# EAGLE design GasSensorCentral_v2.4 (EAGLE 7.4.0)
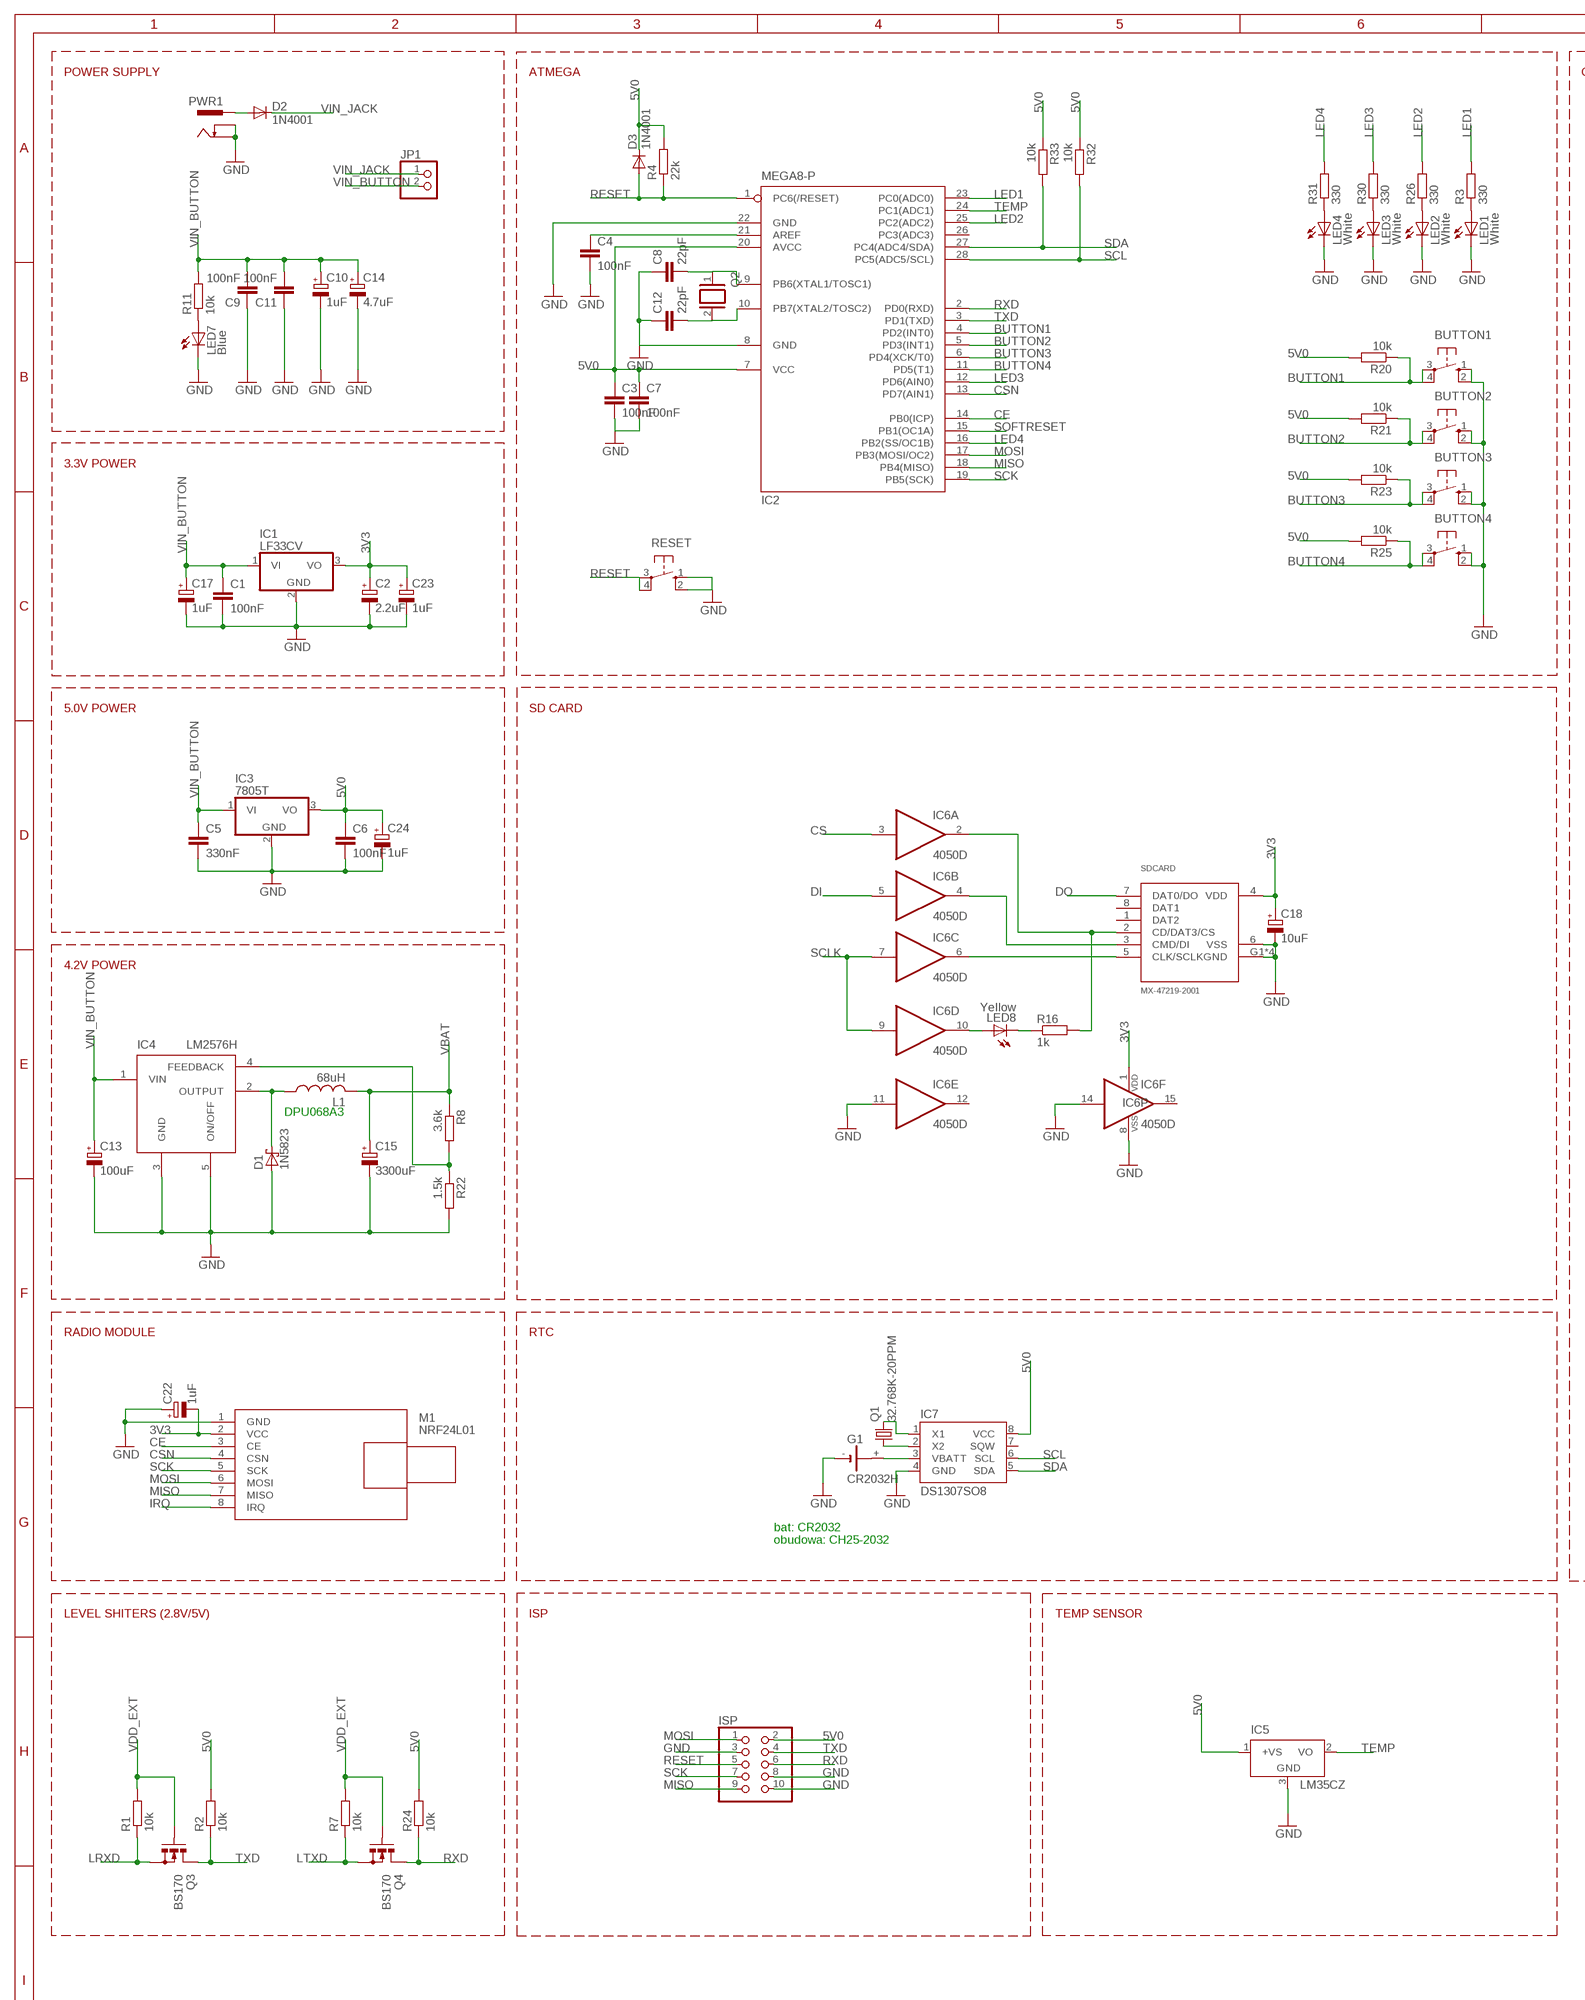
[diagram p0: schematic, sheet 1, part 1 of 2]
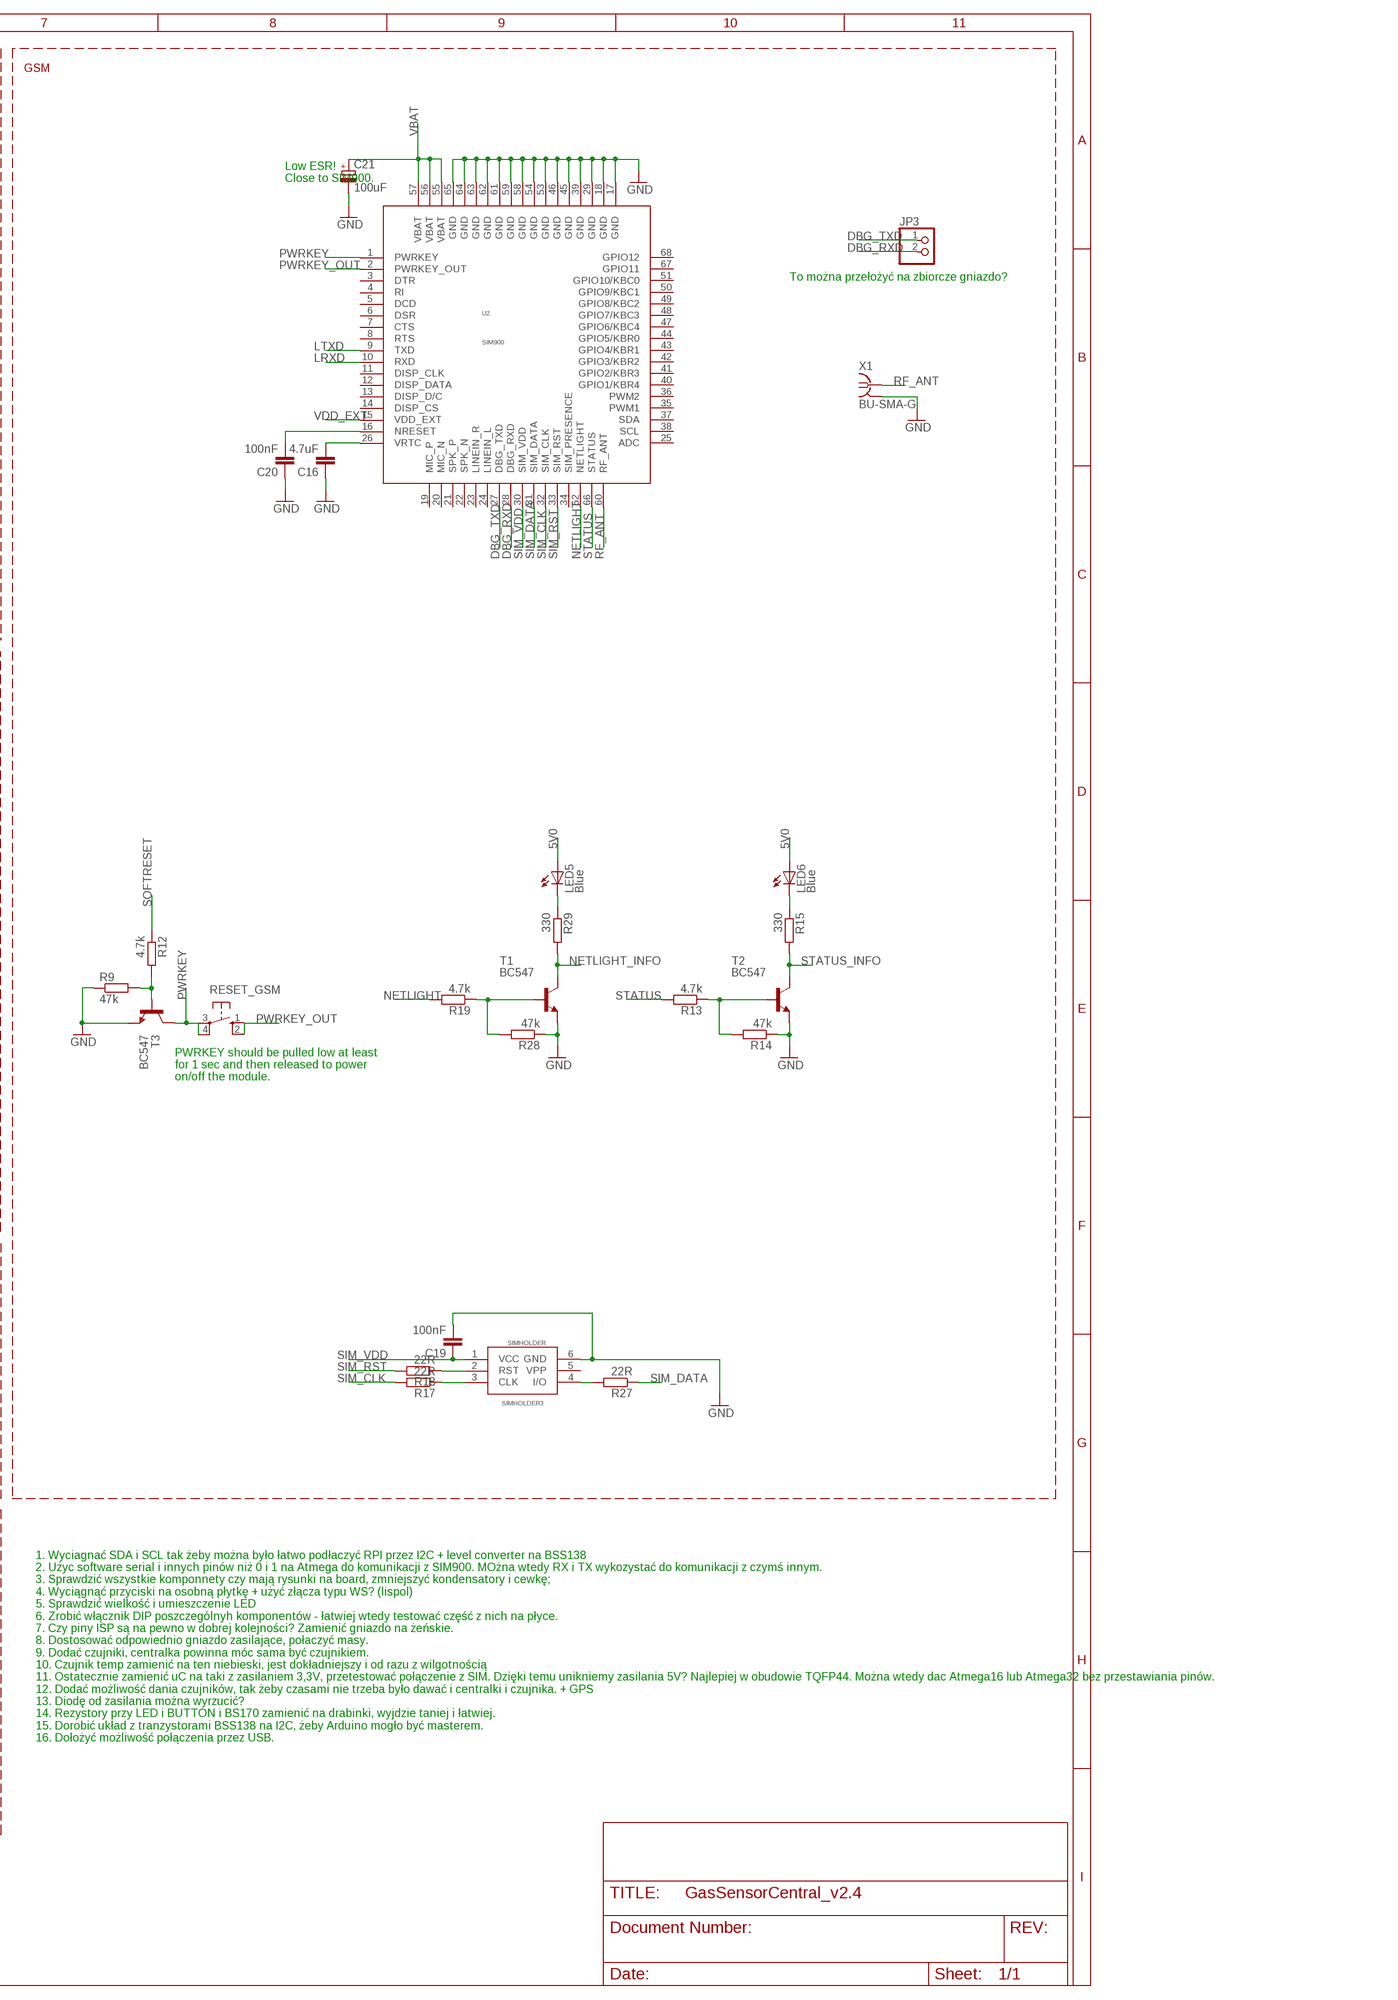
[diagram p1: schematic, sheet 1, part 2 of 2]

## Parts
BUTTON1  10-XX  [B3F-10XX]
BUTTON2  10-XX  [B3F-10XX]
BUTTON3  10-XX  [B3F-10XX]
BUTTON4  10-XX  [B3F-10XX]
C1  100nF  C-EU025-025X050  [C025-025X050]
C2  2.2uF  CPOL-EUE2.5-5  [E2,5-5]
C3  100nF  C-EU025-025X050  [C025-025X050]
C4  100nF  C-EU025-025X050  [C025-025X050]
C5  330nF  C-EU025-025X050  [C025-025X050]
C6  100nF  C-EU025-025X050  [C025-025X050]
C7  100nF  C-EU025-025X050  [C025-025X050]
C8  22pF  C-EU025-025X050  [C025-025X050]
C9  100nF  C-EU025-025X050  [C025-025X050]
C10  1uF  CPOL-EUE2.5-5  [E2,5-5]
C11  100nF  C-EU025-025X050  [C025-025X050]
C12  22pF  C-EU025-025X050  [C025-025X050]
C13  100uF  CPOL-EUE2.5-5  [E2,5-5]
C14  4.7uF  CPOL-EUE2.5-5  [E2,5-5]
C15  3300uF  CPOL-EUE5-13  [E5-13]
C16  4.7uF  C-EU025-025X050  [C025-025X050]
C17  1uF  CPOL-EUE2.5-5  [E2,5-5]
C18  10uF  CPOL-EUE2.5-5  [E2,5-5]
C19  100nF  C-EU025-025X050  [C025-025X050]
C20  100nF  C-EU025-025X050  [C025-025X050]
C21  100uF  CPOL-EUE2.5-5  [E2,5-5]
C22  1uF  CPOL-EUE2.5-5  [E2,5-5]
C23  1uF  CPOL-EUE2.5-5  [E2,5-5]
C24  1uF  CPOL-EUE2.5-5  [E2,5-5]
D1  1N5823  1N5817-B  [DO41-7.6]
D2  1N4001  1N4004  [DO41-10]
D3  1N4001  1N4004  [DO41-10]
G1  CR2032H  [CR2032H]
IC1  LF33CV  7805T  [TO220H]
IC2  MEGA8-P  [DIL28-3]
IC3  7805T  [TO220H]
IC4  LM2576H  [TO220-52]
IC5  LM35CZ  [TO92]
IC6  4050D  [SO16]
IC7  DS1307SO8  [SO08]
ISP  PINHD-2X5  [2X05]
JP1  PINHD-1X2  [1X02]
JP3  PINHD-1X2  [1X02]
L1  68uH  L-USTJ4-U1  [TJ4-U1]
LED1  White  LED3MM  [LED3MM]
LED2  White  LED3MM  [LED3MM]
LED3  White  LED3MM  [LED3MM]
LED4  White  LED3MM  [LED3MM]
LED5  Blue  LED3MM  [LED3MM]
LED6  Blue  LED3MM  [LED3MM]
LED7  Blue  LED3MM  [LED3MM]
LED8  Yellow  LED3MM  [LED3MM]
M1  NRF24L01  WIRELESS-NRF24L01-PA-EXT  [WIRELESS-NRD24L01-PA-EXT]
PWR1  PWR-JAKPWR_JACK_UNI_MILLING  [PWR_JACK_UNI_MILLING]
Q1  32.768K-20PPM  CRYSTALTC26V  [TC26V]
Q2  XTAL/S  [QS]
Q3  BS170  [SOT54E]
Q4  BS170  [SOT54E]
R1  10k  R-EU_0207/10  [0207/10]
R2  10k  R-EU_0207/10  [0207/10]
R3  330  R-EU_0207/10  [0207/10]
R4  22k  R-EU_0207/10  [0207/10]
R7  10k  R-EU_0207/10  [0207/10]
R8  3.6k  R-EU_0207/10  [0207/10]
R9  47k  R-EU_0207/10  [0207/10]
R11  10k  R-EU_0207/10  [0207/10]
R12  4.7k  R-EU_0207/10  [0207/10]
R13  4.7k  R-EU_0207/10  [0207/10]
R14  47k  R-EU_0207/10  [0207/10]
R15  330  R-EU_0207/10  [0207/10]
R16  1k  R-EU_0207/10  [0207/10]
R17  22R  R-EU_0207/10  [0207/10]
R18  22R  R-EU_0207/10  [0207/10]
R19  4.7k  R-EU_0207/10  [0207/10]
R20  10k  R-EU_0207/10  [0207/10]
R21  10k  R-EU_0207/10  [0207/10]
R22  1.5k  R-EU_0207/10  [0207/10]
R23  10k  R-EU_0207/10  [0207/10]
R24  10k  R-EU_0207/10  [0207/10]
R25  10k  R-EU_0207/10  [0207/10]
R26  330  R-EU_0207/10  [0207/10]
R27  22R  R-EU_0207/10  [0207/10]
R28  47k  R-EU_0207/10  [0207/10]
R29  330  R-EU_0207/10  [0207/10]
R30  330  R-EU_0207/10  [0207/10]
R31  330  R-EU_0207/10  [0207/10]
R32  10k  R-EU_0207/10  [0207/10]
R33  10k  R-EU_0207/10  [0207/10]
RESET  10-XX  [B3F-10XX]
RESET_GSM  10-XX  [B3F-10XX]
SDCARD  MX-47219-2001  [MX-47219-2001]
SIMHOLDER  SIMHOLDER3  [SIMHOLDER3]
T1  BC547  [TO92]
T2  BC547  [TO92]
T3  BC547  [TO92]
U2  SIM900  [SIM900]
X1  BU-SMA-G  [BU-SMA-G]

## Nets
3V3: C2.+ C18.+ C22.- C23.+ IC1.3(VO) IC6.1(P:VDD) M1.2(VCC) SDCARD.4(VDD)
5V0: C3.1 C6.1 C7.1 C24.+ D3.C IC2.7(VCC) IC2.20(AVCC) IC3.3(VO) IC5.1(+VS) IC7.8(VCC) ISP.2 LED5.A LED6.A R2.2 R4.2 R20.2 R21.2 R23.2 R24.2 R25.2 R32.1 R33.1
BUTTON1: BUTTON1.3(P) BUTTON1.4(P1) IC2.4(PD2(INT0)) R20.1
BUTTON2: BUTTON2.3(P) BUTTON2.4(P1) IC2.5(PD3(INT1)) R21.1
BUTTON3: BUTTON3.3(P) BUTTON3.4(P1) IC2.6(PD4(XCK/T0)) R23.1
BUTTON4: BUTTON4.3(P) BUTTON4.4(P1) IC2.11(PD5(T1)) R25.1
CE: IC2.14(PB0(ICP)) M1.3(CE)
CS: IC6.3(A:I)
CSN: IC2.13(PD7(AIN1)) M1.4(CSN)
DBG_RXD: JP3.2 U2.28(DBG_RXD)
DBG_TXD: JP3.1 U2.27(DBG_TXD)
DI: IC6.5(B:I)
DO: SDCARD.7(DAT0/DO)
GND: BUTTON1.1(S) BUTTON1.2(S1) BUTTON2.1(S) BUTTON2.2(S1) BUTTON3.1(S) BUTTON3.2(S1) BUTTON4.1(S) BUTTON4.2(S1) C1.2 C2.- C3.2 C4.2 C5.2 C6.2 C7.2 C8.1 C9.1 C10.- C11.1 C12.1 C13.- C14.- C15.- C16.1 C17.- C18.- C19.2 C20.1 C21.- C22.+ C23.- C24.- D1.A G1.- IC1.2(GND) IC2.8(GND) IC2.22(GND) IC3.2(GND) IC4.3(GND) IC4.5(ON/OFF) IC5.3(GND) IC6.8(P:VSS) IC6.11(E:I) IC6.14(F:I) IC7.4(GND) ISP.3 ISP.8 ISP.10 LED1.K(C) LED2.K(C) LED3.K(C) LED4.K(C) LED7.K(C) M1.1(GND) PWR1.- PWR1.-- R9.1 R14.1 R22.2 R28.1 RESET.1(S) RESET.2(S1) SDCARD.6(VSS) SDCARD.G1(GND) SDCARD.G2(GND) SDCARD.G3(GND) SDCARD.G4(GND) SIMHOLDER.6(GND) T1.1(E) T2.1(E) T3.1(E) U2.17(GND) U2.18(GND) U2.29(GND) U2.39(GND) U2.45(GND) U2.46(GND) U2.53(GND) U2.54(GND) U2.58(GND) U2.59(GND) U2.61(GND) U2.62(GND) U2.63(GND) U2.64(GND) U2.65(GND) X1.2 X1.3 X1.4 X1.5
IRQ: M1.8(IRQ)
LED1: IC2.23(PC0(ADC0)) R3.2
LED2: IC2.25(PC2(ADC2)) R26.2
LED3: IC2.12(PD6(AIN0)) R30.2
LED4: IC2.16(PB2(SS/OC1B)) R31.2
LRXD: Q3.S R1.1 U2.10(RXD)
LTXD: Q4.S R7.1 U2.9(TXD)
MISO: IC2.18(PB4(MISO)) ISP.9 M1.7(MISO)
MOSI: IC2.17(PB3(MOSI/OC2)) ISP.1 M1.6(MOSI)
N$1: C4.1 IC2.21(AREF)
N$2: IC7.2(X2) Q1.1
N$3: IC4.4(FEEDBACK) R8.2 R22.1
N$4: D2.A PWR1.+
N$5: LED1.A R3.1
N$6: R27.2 SIMHOLDER.4(I/O)
N$7: LED5.K(C) R29.1
N$8: IC7.1(X1) Q1.2
N$9: R13.1 R14.2 T2.2(B)
N$10: LED7.A R11.1
N$11: LED6.K(C) R15.1
N$12: D1.C IC4.2(OUTPUT) L1.1
N$13: C20.2 U2.16(NRESET)
N$14: R9.2 R12.2 T3.2(B)
N$15: R19.1 R28.2 T1.2(B)
N$16: G1.+ IC7.3(VBATT)
N$17: C16.2 U2.26(VRTC)
N$18: LED2.A R26.1
N$19: LED3.A R30.1
N$20: LED4.A R31.1
N$24: R18.1 SIMHOLDER.2(RST)
N$25: R17.1 SIMHOLDER.3(CLK)
N$26: IC6.2(A:O) R16.2 SDCARD.2(CD/DAT3/CS)
N$27: IC6.4(B:O) SDCARD.3(CMD/DI)
N$29: C8.2 IC2.9(PB6(XTAL1/TOSC1)) Q2.1
N$30: IC6.6(C:O) SDCARD.5(CLK/SCLK)
N$31: IC6.10(D:O) LED8.A
N$32: LED8.K(C) R16.1
N$35: C12.2 IC2.10(PB7(XTAL2/TOSC2)) Q2.2
NETLIGHT: R19.2 U2.52(NETLIGHT)
NETLIGHT_INFO: R29.2 T1.3(C)
PWRKEY: RESET_GSM.3(P) RESET_GSM.4(P1) T3.3(C) U2.1(PWRKEY)
PWRKEY_OUT: RESET_GSM.1(S) RESET_GSM.2(S1) U2.2(PWRKEY_OUT)
RESET: D3.A IC2.1(PC6(/RESET)) ISP.5 R4.1 RESET.3(P) RESET.4(P1)
RF_ANT: U2.60(RF_ANT) X1.1
RXD: IC2.2(PD0(RXD)) ISP.6 Q4.D R24.1
SCK: IC2.19(PB5(SCK)) ISP.7 M1.5(SCK)
SCL: IC2.28(PC5(ADC5/SCL)) IC7.6(SCL) R32.2
SCLK: IC6.7(C:I) IC6.9(D:I)
SDA: IC2.27(PC4(ADC4/SDA)) IC7.5(SDA) R33.2
SIM_CLK: R17.2 U2.32(SIM_CLK)
SIM_DATA: R27.1 U2.31(SIM_DATA)
SIM_RST: R18.2 U2.33(SIM_RST)
SIM_VDD: C19.1 SIMHOLDER.1(VCC) U2.30(SIM_VDD)
SOFTRESET: IC2.15(PB1(OC1A)) R12.1
STATUS: R13.2 U2.66(STATUS)
STATUS_INFO: R15.2 T2.3(C)
TEMP: IC2.24(PC1(ADC1)) IC5.2(VO)
TXD: IC2.3(PD1(TXD)) ISP.4 Q3.D R2.1
VBAT: C15.+ C21.+ L1.2 R8.1 U2.55(VBAT) U2.56(VBAT) U2.57(VBAT)
VDD_EXT: Q3.G Q4.G R1.2 R7.2 U2.15(VDD_EXT)
VIN_BUTTON: C1.1 C5.1 C9.2 C10.+ C11.2 C13.+ C14.+ C17.+ IC1.1(VI) IC3.1(VI) IC4.1(VIN) JP1.2 R11.2
VIN_JACK: D2.C JP1.1
Unconnected: IC2.26(PC3(ADC3)) IC6.12(E:O) IC6.15(F:O) IC7.7(SQW) SDCARD.1(DAT2) SDCARD.8(DAT1) SIMHOLDER.5(VPP) U2.3(DTR) U2.4(RI) U2.5(DCD) U2.6(DSR) U2.7(CTS) U2.8(RTS) U2.11(DISP_CLK) U2.12(DISP_DATA) U2.13(DISP_D/C) U2.14(DISP_CS) U2.19(MIC_P) U2.20(MIC_N) U2.21(SPK_P) U2.22(SPK_N) U2.23(LINEIN_R) U2.24(LINEIN_L) U2.25(ADC) U2.34(SIM_PRESENCE) U2.35(PWM1) U2.36(PWM2) U2.37(SDA) U2.38(SCL) U2.40(GPIO1/KBR4) U2.41(GPIO2/KBR3) U2.42(GPIO3/KBR2) U2.43(GPIO4/KBR1) U2.44(GPIO5/KBR0) U2.47(GPIO6/KBC4) U2.48(GPIO7/KBC3) U2.49(GPIO8/KBC2) U2.50(GPIO9/KBC1) U2.51(GPIO10/KBC0) U2.67(GPIO11) U2.68(GPIO12)

## Notes on the sheet
- POWER SUPPLY | ATMEGA | GSM
- Low ESR!
  Close to SIM900.
- To można przełożyć na zbiorcze gniazdo?
- 3.3V POWER
- 5.0V POWER | SD CARD
- 4.2V POWER
- DPU068A3
- PWRKEY should be pulled low at least 
  for 1 sec and then released to power 
  on/off the module.
- RADIO MODULE | RTC
- bat: CR2032
  obudowa: CH25-2032
- LEVEL SHITERS (2.8V/5V) | ISP | TEMP SENSOR
- 1. Wyciagnać SDA i SCL tak żeby można było łatwo podłaczyć RPI przez I2C + level converter na BSS138
  2. Użyc software serial i innych pinów niż 0 i 1 na Atmega do komunikacji z SIM900. MOżna wtedy RX i TX wykozystać do komunikacji z czymś innym.
  3. Sprawdzić wszystkie komponnety czy mają rysunki na board, zmniejszyć kondensatory i cewkę;
  4. Wyciągnąć przyciski na osobną płytkę + użyć złącza typu WS? (lispol)
  5. Sprawdzić wielkość i umieszczenie LED
  6. Zrobić włącznik DIP poszczególnyh komponentów - łatwiej wtedy testować część z nich na płyce.
  7. Czy piny ISP są na pewno w dobrej kolejności? Zamienić gniazdo na żeńskie.
  8. Dostosować odpowiednio gniazdo zasilające, połaczyć masy.
  9. Dodać czujniki, centralka powinna móc sama być czujnikiem.
  10. Czujnik temp zamienić na ten niebieski, jest dokładniejszy i od razu z wilgotnością
  11. Ostatecznie zamienić uC na taki z zasilaniem 3,3V, przetestować połączenie z SIM. Dzięki temu unikniemy zasilania 5V? Najlepiej w obudowie TQFP44. Można wtedy dac Atmega16 lub Atmega32 bez przestawiania pinów.
  12. Dodać możliwość dania czujników, tak żeby czasami nie trzeba było dawać i centralki i czujnika. + GPS
  13. Diodę od zasilania można wyrzucić?
  14. Rezystory przy LED i BUTTON i BS170 zamienić na drabinki, wyjdzie taniej i łatwiej.
  15. Dorobić układ z tranzystorami BSS138 na I2C, żeby Arduino mogło być masterem.
  16. Dołożyć możliwość połączenia przez USB.

## Library data of the parts
BUTTON1-BUTTON4 RESET RESET_GSM = switch-omron:10-XX: OMRON SWITCH; MPN: B3F-1000; OC_FARNELL: 176432; OC_NEWARK: 36M3542
C1 C3-C9 C11 C12 C16 C19 C20 = rcl:C-EU: CAPACITOR, European symbol
C2 C10 C13-C15 C17 C18 C21-C24 = rcl:CPOL-EU: POLARIZED CAPACITOR, European symbol
D1 = diode:1N581*: 1.0A SCHOTTKY BARRIER RECTIFIER Source: http://www.diodes.com/datasheets/ds23001.pdf
D2 D3 = diode:1N4004: DIODE general purpose rectifier, 1 A
G1 = hosho:CR2032H: LI BATTERY Varta
IC1 IC3 = linear:78*: Positive VOLTAGE REGULATOR Source: http://cache.national.com/ds/LM/LM78L05.pdf http://www.fairchildsemi.com/ds/LM/LM7805.pdf
IC2 = atmel:MEGA8-P: MICROCONTROLLER 8 Kbytes FLASH, 1 kbytes SRAM, 512 bytes EEPROM, USART, 4-channel 10 bit ADC, 2-channel 8 bit ADC Pin compatible with Atmega48, ATMega88, ATMega168 Source: avr.lbr; OC_FARNELL: unknown; OC_NEWARK: unknown
IC4 = hosho:LM2576H
IC5 = lm35:LM35: Single-Supply Centigrade Temperature Sensor Vout = (10mV/°C x Temp °C) +5mmmV Source: http://www.national.com/ds/LM/LM35.pdf
IC6 = 40xx:4050: Hex non-inverting BUFFER
IC7 = SparkFun-FreqCtrl:DS1307: I2C real-time clock with battery backup.
ISP = pinhead:PINHD-2X5: PIN HEADER
JP1 JP3 = pinhead:PINHD-1X2: PIN HEADER
L1 = rcl:L-US: INDUCTOR, American symbol
LED1-LED8 = led:LED: LED OSRAM: - CHIPLED LG R971, LG N971, LY N971, LG Q971, LY Q971, LO R971, LY R971 LH N974, LH R974 LS Q976, LO Q976, LY Q976 LO Q996 - Hyper CHIPLED LW Q18S LB Q993, LB Q99A, LB R99A - SideLED LS A670, LO A670, LY A670, LG A670, LP A670 LB A673, LV A673, LT A673, LW A673 LH A674 LY A675 LS A676, LA A676, LO A676, LY A676, LW A676 LS A679, LY A679, LG A679 - Hyper Micro SIDELED® LS Y876, LA Y876, LO Y876, LY Y876 LT Y87S - SmartLED LW L88C, LW L88S LB L89C, LB L89S, LG L890 LS L89K, LO L89K, LY L89K LS L896, LA L896, LO L896, LY L896 - TOPLED LS T670, LO T670, LY T670, LG T670, LP T670 LSG T670, LSP T670, LSY T670, LOP T670, LYG T670 LG T671, LOG T671, LSG T671 LB T673, LV T673, LT T673, LW T673 LH T674 LS T676, LA T676, LO T676, LY T676, LB T676, LH T676, LSB T676, LW T676 LB T67C, LV T67C, LT T67C, LS T67K, LO T67K, LY T67K, LW E67C LS E67B, LA E67B, LO E67B, LY E67B, LB E67C, LV E67C, LT E67C LW T67C LS T679, LY T679, LG T679 LS T770, LO T770, LY T770, LG T770, LP T770 LB T773, LV T773, LT T773, LW T773 LH T774 LS E675, LA E675, LY E675, LS T675 LS T776, LA T776, LO T776, LY T776, LB T776 LHGB T686 LT T68C, LB T68C - Hyper Mini TOPLED® LB M676 - Mini TOPLED Santana® LG M470 LS M47K, LO M47K, LY M47K Source: http://www.osram.convergy.de LUXEON: - LUMILED® LXK2-PW12-R00, LXK2-PW12-S00, LXK2-PW14-U00, LXK2-PW14-V00 LXK2-PM12-R00, LXK2-PM12-S00, LXK2-PM14-U00 LXK2-PE12-Q00, LXK2-PE12-R00, LXK2-PE12-S00, LXK2-PE14-T00, LXK2-PE14-U00 LXK2-PB12-K00, LXK2-PB12-L00, LXK2-PB12-M00, LXK2-PB14-N00, LXK2-PB14-P00, LXK2-PB14-Q00 LXK2-PR12-L00, LXK2-PR12-M00, LXK2-PR14-Q00, LXK2-PR14-R00 LXK2-PD12-Q00, LXK2-PD12-R00, LXK2-PD12-S00 LXK2-PH12-R00, LXK2-PH12-S00 LXK2-PL12-P00, LXK2-PL12-Q00, LXK2-PL12-R00 Source: www.luxeon.com KINGBRIGHT: KA-3528ASYC Source: www.kingbright.com
M1 = diy-modules:WIRELESS-NRF24L01-PA-EXT: 2.4 GHz Wireless Module based on NRF24L01 chip with preamplifier and external antenna
PWR1 = iMX233-OLINUXINO-MAXI_Rev_D:PWR-JAK
Q1 = crystal:CRYSTAL: CRYSTAL; OC_FARNELL: unknown; OC_NEWARK: unknown
Q2 = special:XTAL/S: CRYSTAL
Q3 Q4 = transistor-small-signal:BS170: N-CHANNEL MOS FET
R1-R4 R7-R9 R11-R33 = rcl:R-EU_: RESISTOR, European symbol
SDCARD = hosho:MX-47219-2001
SIMHOLDER = SparkFun2:SIMHOLDER3
T1-T3 = transistor:BC547: NPN TRANSISTOR
U2 = ICs_v54:SIM900
X1 = hosho:BU-SMA-G: FEMALE SMA CONNECTOR Radiall distributor RS 193-9117; OC_FARNELL: unknown; OC_NEWARK: unknown

## Board
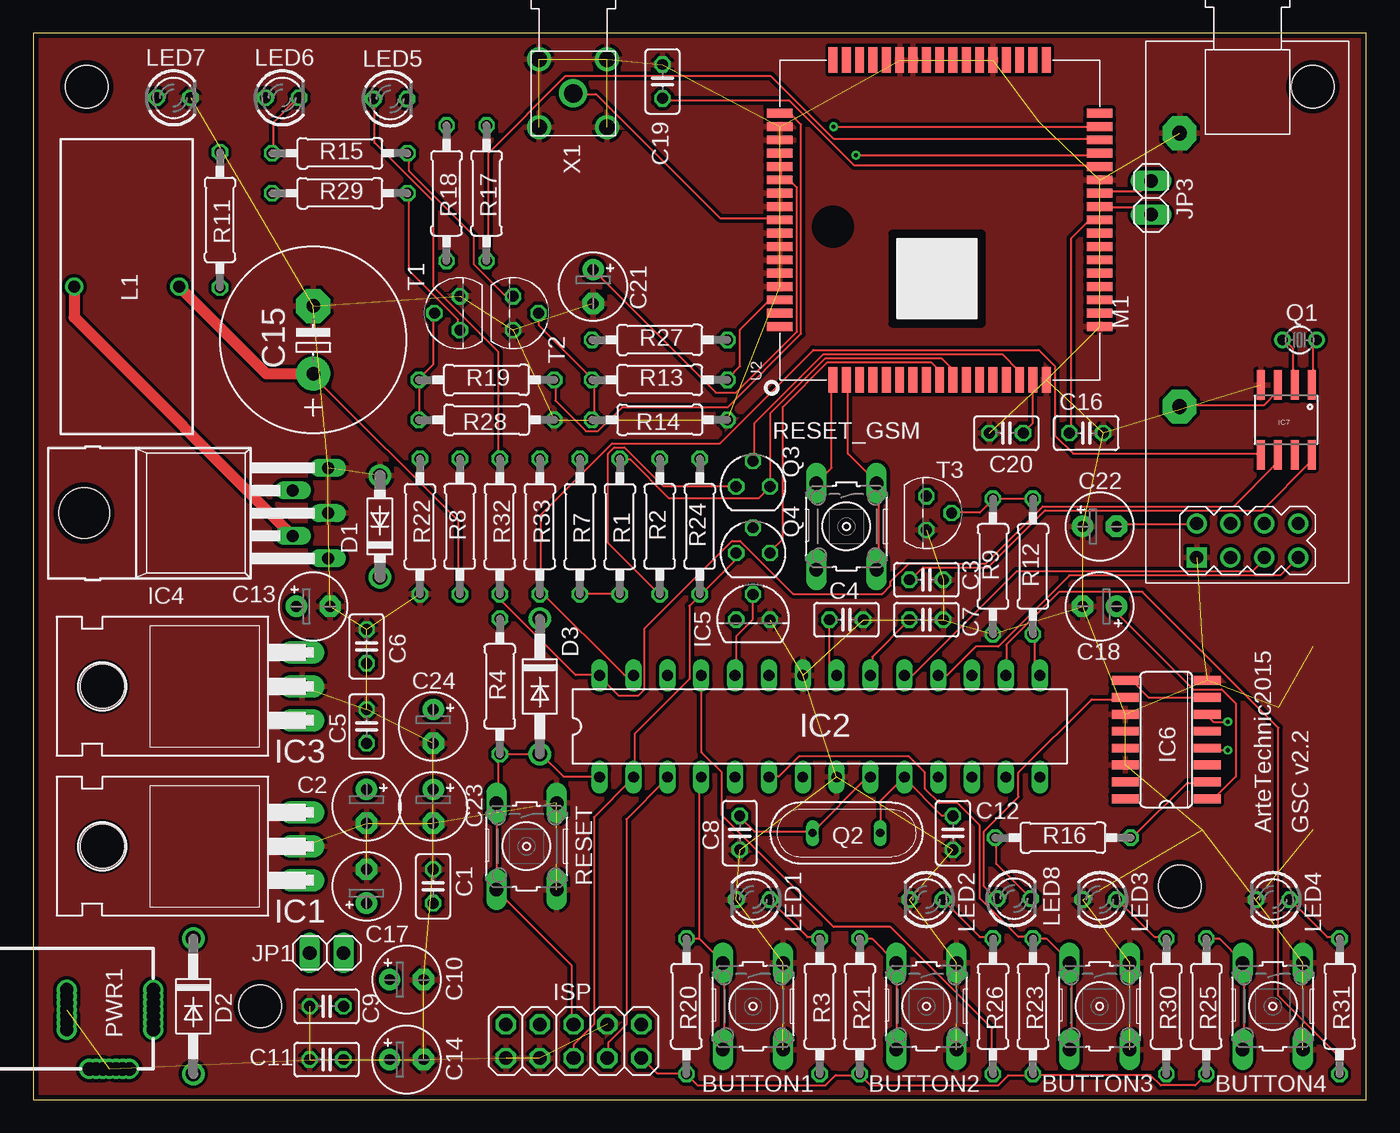
[diagram p2: board, top side]
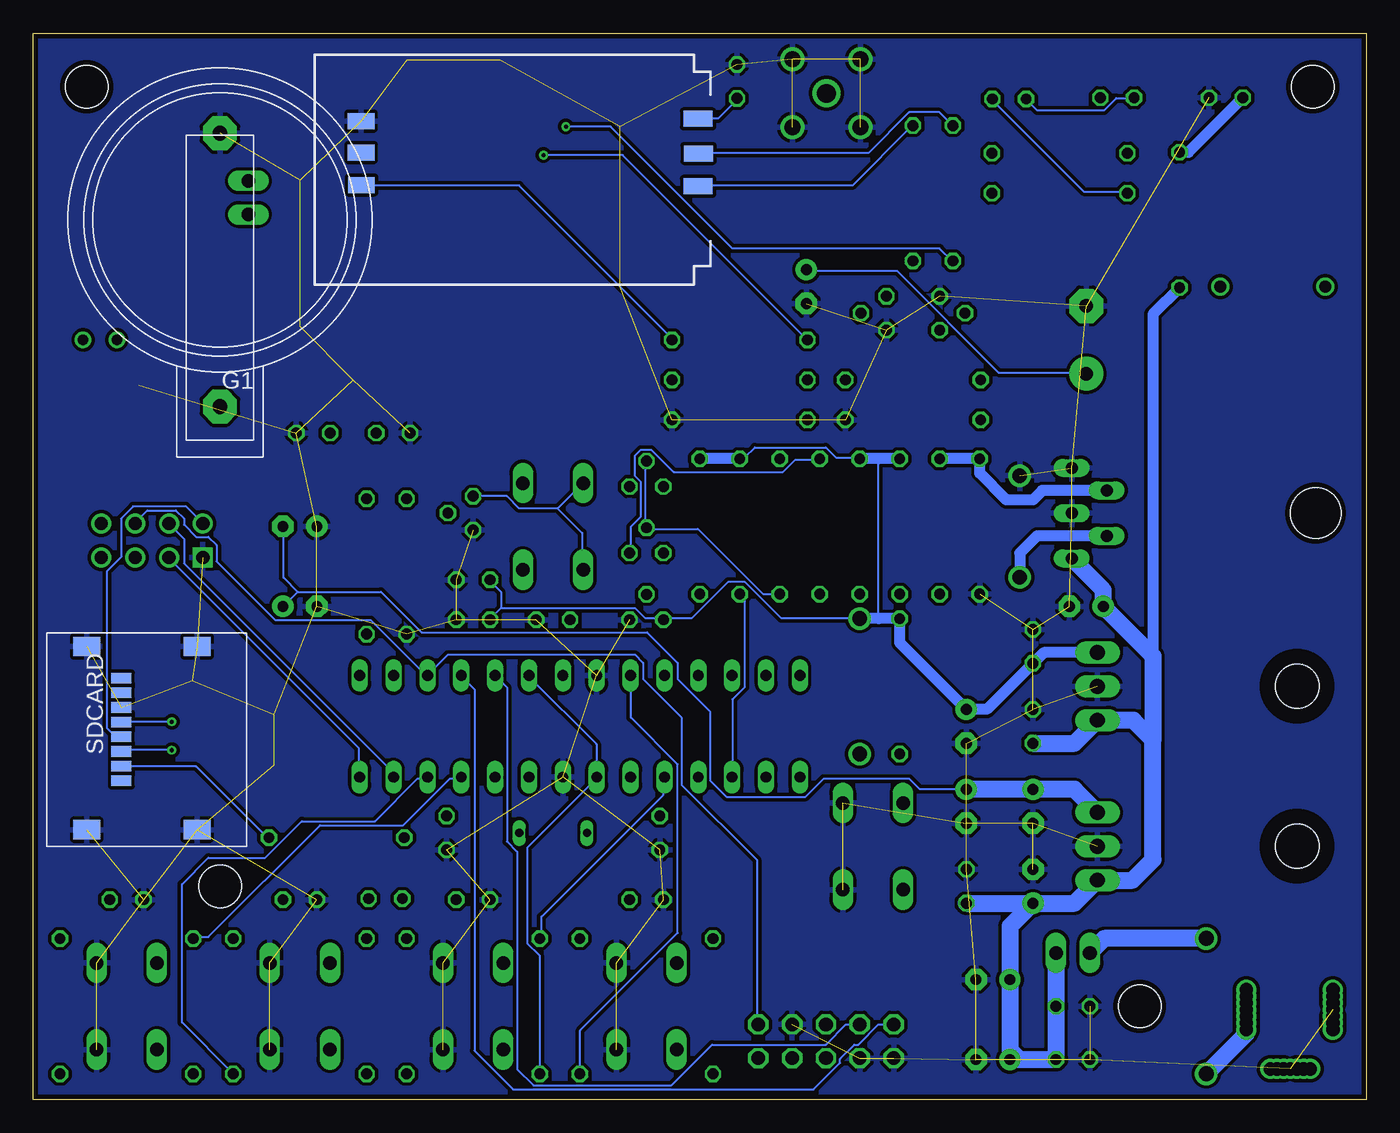
[diagram p3: board, bottom side, seen from below]

Size 100 x 80 mm. Coordinates in mm from the lower left corner, seen from the top.
Outline: 0,0 100,0 100,80 0,80 0,0
Copper layers (1*16): Top 0.0356mm / dielectric 1.5011mm / Bottom 0.0356mm
Design rules "oshpark-2layer *": minimum track width 6mil, minimum drill 13mil, track to track 6mil, track to pad 6mil, pad to pad 6mil, via to via 6mil, smd to smd 6mil, copper to edge 15mil, drill to drill 6mil, minimum pad ring 7mil, minimum via ring 7mil, stop-mask expansion 4mil, vias tented up to drill 12mil, thermal gap 10mil
Holes 3.2 mm at 17,7 86,16 96,76 4,76
tRestrict: area 64.4,58.2 to 71.2,65

### Footprints (pad centres in the part's own frame; a part is rotated, then mirrored left to right if it is on the bottom)
B3F-10XX = drill 1.016 long: 1 -3.251,2.261; 2 3.251,2.261; 3 -3.251,-2.261; 4 3.251,-2.261
C025-025X050 = drill 0.813 octagon: 1 -1.27,0; 2 1.27,0
E2,5-5 = drill 0.813 pad 1.6: + -1.27,0 | drill 0.813 pad 1.6 octagon: - 1.27,0
E5-13 = drill 1.016 pad 2.54: + -2.54,0 | drill 1.016 pad 2.54 octagon: - 2.54,0
DO41-7.6 = drill 1.1 pad 1.7: A 3.81,0; C -3.81,0
DO41-10 = drill 1.118: A 5.08,0; C -5.08,0
CR2032H = drill 1.118 pad 2.54 octagon: + 0,14; - 0,-6.5
TO220H = drill 1.118 long: 1 -2.54,-10.16; 2 0,-10.16; 3 2.54,-10.16 | hole 3.302: 0,4.826
DIL28-3 = drill 0.813 long: 1 -16.51,-3.81; 2 -13.97,-3.81; 3 -11.43,-3.81; 4 -8.89,-3.81; 5 -6.35,-3.81; 6 -3.81,-3.81; 7 -1.27,-3.81; 8 1.27,-3.81; 9 3.81,-3.81; 10 6.35,-3.81; 11 8.89,-3.81; 12 11.43,-3.81; 13 13.97,-3.81; 14 16.51,-3.81; 15 16.51,3.81; 16 13.97,3.81; 17 11.43,3.81; 18 8.89,3.81; 19 6.35,3.81; 20 3.81,3.81; 21 1.27,3.81; 22 -1.27,3.81; 23 -3.81,3.81; 24 -6.35,3.81; 25 -8.89,3.81; 26 -11.43,3.81; 27 -13.97,3.81; 28 -16.51,3.81
TO220-52 = drill 0.9 long: 1 -3.4,-21.1; 2 -1.7,-18.47; 3 0,-21.1; 4 1.7,-18.47; 5 3.4,-21.1 | hole 3.8: 0,-2.8
TO92 = drill 0.813 octagon: 1 -1.27,0; 2 0,1.905; 3 1.27,0
SO16 = smd 0.66 x 2.032: 1 -4.445,-3.073; 2 -3.175,-3.073; 3 -1.905,-3.073; 4 -0.635,-3.073; 5 0.635,-3.073; 6 1.905,-3.073; 7 3.175,-3.073; 8 4.445,-3.073; 9 4.445,3.073; 10 3.175,3.073; 11 1.905,3.073; 12 0.635,3.073; 13 -0.635,3.073; 14 -1.905,3.073; 15 -3.175,3.073; 16 -4.445,3.073
SO08 = smd 0.61 x 2.21: 1 -1.905,-2.616; 2 -0.635,-2.616; 3 0.635,-2.616; 4 1.905,-2.616; 5 1.905,2.616; 6 0.635,2.616; 7 -0.635,2.616; 8 -1.905,2.616
2X05 = drill 1.016 octagon: 1 -5.08,-1.27; 2 -5.08,1.27; 3 -2.54,-1.27; 4 -2.54,1.27; 5 0,-1.27; 6 0,1.27; 7 2.54,-1.27; 8 2.54,1.27; 9 5.08,-1.27; 10 5.08,1.27
1X02 = drill 1.016 long: 1 -1.27,0; 2 1.27,0
TJ4-U1 = drill 0.9: 1 -3.935,0; 2 3.935,0
LED3MM = drill 0.813 octagon: A -1.27,0; K 1.27,0
WIRELESS-NRD24L01-PA-EXT = drill 1 square: 1 -18.415,3.81 | drill 1: 2 -15.875,3.81; 3 -18.415,1.27; 4 -15.875,1.27; 5 -18.415,-1.27; 6 -15.875,-1.27; 7 -18.415,-3.81; 8 -15.875,-3.81
PWR_JACK_UNI_MILLING = drill 1: + 0,4.75; +1 0,5.25; +2 0,5.75; +3 0,6.25; +4 0,4.25; +5 0,3.75; +6 0,3.25; - -6.5,4.75; -1 -6.5,5.25; -2 -6.5,5.75; -3 -6.5,4.25; -4 -6.5,3.75; -5 -6.5,6.25; -6 -6.5,3.25; -- -3.3,0.3; --1 -3.8,0.3; --2 -4.3,0.3; --3 -4.8,0.3; --4 -2.8,0.3; --5 -2.3,0.3; --6 -1.8,0.3
TC26V = drill 0.813: 1 -1.27,0; 2 1.27,0
QS = drill 0.61 long: 1 -2.54,0; 2 2.54,0
SOT54E = drill 0.813 octagon: D -1.27,0; G 0,1.905; S 1.27,0
0207/10 = drill 0.813 octagon: 1 -5.08,0; 2 5.08,0
MX-47219-2001 = smd 0.8 x 1.5: 1 10.08,2.6; 2 8.98,2.6; 3 7.88,2.6; 4 6.78,2.6; 5 5.68,2.6; 6 4.58,2.6; 7 3.48,2.6; 8 2.38,2.6 | smd 1.45 x 2: G1 13.75,0; G2 13.75,8.3; G3 0,8.3; G4 0,0
SIMHOLDER3 = smd 2.2 x 1.2: 1 0.95,4.81; 2 0.91,7.41; 3 0.95,9.86 | smd 2 x 1.2: 4 26.2,9.78; 5 26.22,7.34; 6 26.22,4.98
TO92' = drill 0.813 octagon: 1 1.27,0; 2 0,1.905; 3 -1.27,0
SIM900 = smd 1.93 x 0.66: 1 -12,8; 2 -12,7; 3 -12,6; 4 -12,5; 5 -12,4; 6 -12,3; 7 -12,2; 8 -12,1; 9 -12,0; 10 -12,-1; 11 -12,-2; 12 -12,-3; 13 -12,-4; 14 -12,-5; 15 -12,-6; 16 -12,-7; 17 -12,-8; 35 12,-8; 36 12,-7; 37 12,-6; 38 12,-5; 39 12,-4; 40 12,-3; 41 12,-2; 42 12,-1; 43 12,0; 44 12,1; 45 12,2; 46 12,3; 47 12,4; 48 12,5; 49 12,6; 50 12,7; 51 12,8 | smd 0.66 x 1.93: 18 -8,-12; 19 -7,-12; 20 -6,-12; 21 -5,-12; 22 -4,-12; 23 -3,-12; 24 -2,-12; 25 -1,-12; 26 0,-12; 27 1,-12; 28 2,-12; 29 3,-12; 30 4,-12; 31 5,-12; 32 6,-12; 33 7,-12; 34 8,-12; 52 8,12; 53 7,12; 54 6,12; 55 5,12; 56 4,12; 57 3,12; 58 2,12; 59 1,12; 60 0,12; 61 -1,12; 62 -2,12; 63 -3,12; 64 -4,12; 65 -5,12; 66 -6,12; 67 -7,12; 68 -8,12
BU-SMA-G = drill 1.4: 1 0,0 | drill 1.2: 2 -2.55,2.55; 3 2.55,2.55; 4 2.55,-2.55; 5 -2.55,-2.55

### Placement (x,y rotation side)
BUTTON1  54,7 270 top
BUTTON2  67,7 270 top
BUTTON3  80,7 270 top
BUTTON4  93,7 270 top
C1  30,16 90 top
C2  25,22 270 top
C3  67,39 0 top
C4  61,36 0 top
C5  25,28 90 top
C6  25,34 90 top
C7  67,36 0 top
C8  53,20 90 top
C9  22,7 0 top
C10  28,9 0 top
C11  22,3 0 top
C12  69,20 90 top
C13  21,37 0 top
C14  28,3 0 top
C15  21,57 90 top
C16  79,50 180 top
C17  25,16 90 top
C18  80,37 180 top
C19  47.21,76.39 90 top
C20  73,50 0 top
C21  42,61 270 top
C22  80,43 0 top
C23  30,22 270 top
C24  30,28 270 top
D1  26,43 90 top
D2  12,7 270 top
D3  38,31 270 top
G1  86,66 180 bottom
IC1  10,19 90 top
IC2  59,28 0 top
IC3  10,31 90 top
IC4  1,44 90 top
IC5  54,36 0 top
IC6  85,27 90 top
IC7  94,51 180 top
ISP  40.53,4.37 180 top
JP1  22,11 0 top
JP3  83.86,67.67 90 top
L1  7,61 0 top
LED1  54,15 180 top
LED2  67,15 180 top
LED3  80,15 180 top
LED4  93,15 180 top
LED5  26.78,75.08 0 top
LED6  18.68,75.16 0 top
LED7  10.52,75.16 0 top
LED8  73.58,15.08 0 top
M1  91.09,59.09 90 top
PWR1  9,2 0 top
Q1  95,57 0 top
Q2  61,20 0 top
Q3  54,46 0 top
Q4  54,41 0 top
R1  44,43 270 top
R2  47,43 90 top
R3  59,7 270 top
R4  35,31 90 top
R7  41,43 270 top
R8  32,43 90 top
R9  72,40 90 top
R11  14,66 270 top
R12  75,40 90 top
R13  47,54 0 top
R14  47,51 180 top
R15  23,71 0 top
R16  77.25,19.65 0 top
R17  34,68 270 top
R18  31,68 270 top
R19  34,54 0 top
R20  49,7 270 top
R21  62,7 270 top
R22  29,43 270 top
R23  75,7 270 top
R24  50,43 90 top
R25  88,7 270 top
R26  72,7 270 top
R27  47,57 0 top
R28  34,51 180 top
R29  23,68 0 top
R30  85,7 270 top
R31  98,7 270 top
R32  35,43 270 top
R33  38,43 270 top
RESET  37,19 270 top
RESET_GSM  61,43 270 top
SDCARD  96,34 270 bottom
SIMHOLDER  49.18,78.39 180 bottom
T1  BC547  [TO92']  32,59 90 top
T2  BC547  [TO92']  36,59 270 top
T3  BC547  [TO92']  67,44 270 top
U2  68,66 90 top
X1  40.5,75.5 90 top

### Tracks (layer width: path | path; a pad name or v marks a point on that pad's centre or on a via)
3V3
  Top 0.152: C22.- 81.38,43.13 87.17,43.13 M1.2 | IC6.1 88.09,22.55 88.54,22.55 90.22,24.23 90.22,29.72 89.15,30.79 87.02,30.79 81.38,36.42 81.38,36.88 C18.+
  Bottom 0.152: SDCARD.4 93.42,27.28 93.88,27.28 94.49,27.89 94.49,39.62 93.42,40.69 93.42,43.59 92.51,44.5 88.54,44.5 87.33,43.28 M1.2 | 80.16,38.1 73.91,38.1 70.87,35.05 53.95,35.05 51.66,32.77 51.66,31.55 49.23,29.11 49.23,23.93 48.01,22.71 42.06,22.71 40.69,24.08 34.29,24.08 33.53,23.32 30.63,23.32 C23.+ | 80.16,38.1 81.23,37.03 C18.+ | 80.16,38.1 81.23,39.17 81.23,42.98 C22.-
  Bottom 1.27: IC1.3 21.89,23.27 C2.+ C23.+
5V0
  Top 0.152: LED5.A 25.6,74.98 25.6,71.78 30.02,67.36 30.02,60.96 34.9,56.08 34.9,48.16 R32.1 | R25.2 87.94,1.83 87.17,1.07 84.58,1.07 83.82,1.83 75.13,1.83 R23.2 74.98,1.83 73.15,1.83 72.39,1.07 62.79,1.07 62.03,1.83 R21.2 61.87,1.83 60.2,1.83 59.44,1.07 49.84,1.07 49.07,1.83 R20.2 48.92,1.98 46.79,1.98 45.72,3.05 ISP.2 | IC2.20 62.94,31.85 62.94,33.22 65.68,35.97 C7.1 | IC7.8 95.86,48.31 95.86,47.85 92.2,44.2 75.89,44.2 71.63,39.93 66.75,39.93 65.84,39.01 C3.1
  Bottom 0.152: LED6.A 17.53,75.13 18.75,75.13 19.66,74.22 24.69,74.22 25.45,74.98 LED5.A | R33.1 38.41,48.16 39.78,48.16 40.54,48.92 45.87,48.92 46.63,48.16 R2.2 | 36.58,36.08 36.58,48.08 | IC2.20 62.79,31.7 57.76,26.67 57.76,24.23 IC2.7 57.76,24.08 62.94,18.9 62.94,11.73 62.03,10.82 62.03,1.98 R21.2 | 64.92,36.88 54.86,36.88 54.1,36.12 52.73,36.12 IC5.1 52.58,36.12 50.6,36.12 47.85,38.86 46.63,38.86 43.89,36.12 38.41,36.12 D3.C | 64.92,36.88 65.68,36.12 C7.1 | 64.92,36.88 64.92,38.1 65.68,38.86 C3.1
  Bottom 0.254: 38.18,36.35 D3.C
  Bottom 0.813: IC3.3 24.19,33.54 C6.1 28.46,29.27 C24.+ 35,34.27 R4.2 36.58,36.08 D3.C | R32.1 36.58,48.08 R33.1 | R2.2 R24.2
BUTTON1
  Top 0.152: 49.99,12.04 49.07,12.04 R20.1 | 49.99,12.04 51.66,10.36 BUTTON1.3 51.82,10.21 51.82,3.81 BUTTON1.4 | 49.99,12.04 49.99,24.08 IC2.4
BUTTON2
  Top 0.152: R21.1 62.03,12.04 62.94,12.04 64.62,10.36 BUTTON2.3 64.77,10.21 64.77,3.81 BUTTON2.4
  Bottom 0.152: IC2.5 52.73,24.08 52.73,22.86 61.87,13.72 61.87,12.19 R21.1
BUTTON3
  Top 0.152: IC2.6 55.32,24.23 55.93,24.23 57.45,25.76 65.68,25.76 66.9,24.54 66.9,23.32 67.97,22.25 69.34,22.25 71.02,20.57 71.02,15.09 73.91,12.19 74.98,12.19 R23.1 75.13,12.04 76.05,12.04 77.72,10.36 BUTTON3.3 77.88,10.21 77.88,3.81 BUTTON3.4
BUTTON4
  Top 0.152: R25.1 88.09,12.04 89,12.04 90.68,10.36 BUTTON4.3 90.83,10.21 90.83,3.81 BUTTON4.4
  Bottom 0.152: IC2.11 67.97,24.08 68.73,24.08 72.24,20.57 78.49,20.57 86.87,12.19 87.94,12.19 R25.1
CE
  Bottom 0.152: IC2.14 75.59,24.23 75.59,26.36 89.76,40.54 M1.3
CSN
  Bottom 0.152: IC2.13 73,24.23 73,24.54 88.7,40.23 88.7,42.06 89.76,43.13 M1.4
DBG_RXD
  Top 0.152: U2.28 80.01,68.12 83.06,68.12 83.82,68.89 JP3.2
DBG_TXD
  Top 0.152: U2.27 80.01,66.9 83.36,66.9 83.82,66.45 JP3.1
GND  (89 unrouted)
  pour Bottom (isolate 0.254): 0,80 100,80 100,0 0,0
  pour Top (isolate 0.254): 0,80 100,80 100,0 0,0
LED1
  Bottom 0.152: IC2.23 55.17,31.7 55.17,28.65 51.66,25.15 51.66,12.5 58.98,5.18 58.98,1.98 R3.2
LED2
  Top 0.152: IC2.25 50.14,31.7 50.14,26.06 51.66,24.54 51.66,21.34 60.05,12.95 64.31,12.95 71.93,5.33 71.93,1.98 R26.2
LED3
  Bottom 0.152: IC2.12 70.56,24.08 71.17,24.08 74.37,20.88 79.86,20.88 82.6,18.14 86.87,18.14 88.85,16.15 88.85,5.79 85.04,1.98 R30.2
LED4
  Top 0.152: IC2.16 73,31.85 73,34.14 76.96,38.1 83.21,38.1 93.42,27.89 93.42,7.77 97.99,3.2 97.99,1.98 R31.2
LRXD
  Top 0.152: U2.10 68.89,54.1 68.89,54.86 68.12,55.63 59.44,55.63 55.32,51.51 55.32,46.02 Q3.S 55.17,45.87 54.41,45.11 47.7,45.11 44.81,48.01 44.04,48.01 R1.1
LTXD
  Top 0.152: U2.9 67.97,54.1 67.97,54.71 67.36,55.32 59.59,55.32 56.24,51.97 56.24,42.06 55.32,41.15 Q4.S
  Bottom 0.152: R7.1 41.15,48.01 42.82,48.01 43.74,47.09 51.97,47.09 53.65,48.77 54.41,48.77 54.86,48.31 54.86,46.79 54.41,46.33 54.41,43.74 55.17,42.98 55.17,41.15 Q4.S
MISO
  Top 0.152: IC2.18 67.97,31.85 68.58,31.85 70.71,33.98 72.39,33.98 77.72,39.32 93.57,39.32 94.79,40.54 M1.7
  Bottom 0.152: ISP.9 35.51,5.64 36.58,5.64 38.1,4.12 38.41,4.12 39.47,3.05 39.47,2.74 41.45,0.76 64.01,0.76 66.9,3.66 66.9,30.79 67.82,31.7 IC2.18
MOSI
  Bottom 0.152: M1.6 92.35,43.28 91.44,44.2 89.31,44.2 88.7,43.59 88.7,43.13 87.78,42.22 86.87,42.22 86.26,41.6 86.26,40.39 81.84,35.97 74.68,35.97 70.56,31.85 IC2.17 70.41,31.85 68.89,33.38 54.86,33.38 54.25,32.77 54.25,31.55 51.36,28.65 51.36,23.62 45.72,17.98 45.72,5.79 ISP.1
N$1
  Top 0.152: C4.1 59.74,35.97 59.74,32.31 60.2,31.85 IC2.21
N$2
  Top 0.152: IC7.2 94.49,53.65 94.49,56.39 93.88,57 Q1.1
N$3
  Bottom 0.813: IC4.4 24.3,45.7 25,45 27,45 29,47 R22.1 R8.2
N$4
  Bottom 1.27: PWR1.+ 9,4.92 D2.A
N$5
  Top 0.152: R3.1 58.98,12.19 58.06,12.19 55.32,14.94 LED1.A
N$6
  Bottom 0.152: SIMHOLDER.4 75.29,68.58 63.55,68.58 52.12,57.15 R27.2
N$7
  Bottom 0.152: R29.1 17.98,68.12 21.18,68.12 28.04,74.98 LED5.K
N$8
  Top 0.152: IC7.1 96.01,53.65 96.01,56.84 96.16,57 Q1.2
N$9
  Top 0.152: T2.2 37.95,58.98 37.95,58.06 41.91,54.1 R13.1 42.06,53.95 42.06,51.05 R14.2
N$10
  Bottom 0.813: LED7.A 13.33,71.08 R11.1
N$11
  Top 0.152: R15.1 17.98,71.02 17.98,73.3 19.81,75.13 LED6.K
N$12
  Top 0.813: L1.1 3.06,58.7 IC4.2
  Bottom 0.813: IC4.2 24.7,42.3 26,41 D1.C
N$13
  Top 0.152: U2.16 74.98,53.95 74.98,50.75 74.37,50.14 C20.2
N$14
  Top 0.152: T3.2 69.04,44.04 71.02,44.04 71.93,44.96 R9.2 72.08,45.11 74.98,45.11 R12.2
N$15
  Top 0.152: R28.2 28.96,51.05 28.96,53.95 R19.1 28.96,54.1 30.02,55.17 30.02,58.98 T1.2
N$16
  Top 0.152: IC7.3 93.27,53.49 93.27,53.03 92.35,52.12 86.11,52.12 G1.+
N$17
  Top 0.152: U2.26 79.86,65.99 79.25,65.99 77.88,64.62 77.88,50.14 C16.2
N$18
  Top 0.152: R26.1 71.93,12.19 71.02,12.19 68.28,14.94 LED2.A
N$19
  Top 0.152: R30.1 84.89,12.19 84.12,12.19 81.38,14.94 LED3.A
N$20
  Top 0.152: R31.1 97.99,12.19 97.08,12.19 94.34,14.94 LED4.A
N$24
  Bottom 0.152: SIMHOLDER.2 49.99,71.02 37.34,71.02 34.29,74.07 32,74.07 31.09,73.15 R18.1
N$25
  Bottom 0.152: SIMHOLDER.3 49.99,68.58 38.56,68.58 34.14,73 R17.1
N$26
  Top 0.152: IC6.2 87.94,23.77 86.56,23.77 82.45,19.66 R16.2
  Bottom 0.152: SDCARD.2 93.27,24.99 87.78,24.99 82.45,19.66 R16.2
N$27  (via drill 0.3)
  Top 0.152: v89.61,26.21 88.09,26.21 IC6.4
  Bottom 0.152: v89.61,26.21 93.27,26.21 SDCARD.3
N$29
  Top 0.152: C8.2 53.03,21.18 54.1,20.12 58.37,20.12 Q2.1 58.52,20.12 62.48,24.08 62.79,24.08 IC2.9
N$30  (via drill 0.3)
  Top 0.152: v89.61,28.35 88.54,28.35 88.09,28.8 IC6.6
  Bottom 0.152: v89.61,28.35 93.27,28.35 SDCARD.5
N$31
  Top 0.152: IC6.10 81.84,30.02 79.4,30.02 73.91,24.54 73.91,22.71 71.32,20.12 71.32,16 72.24,15.09 LED8.A
N$32
  Top 0.152: R16.1 72.24,19.51 72.24,17.68 74.83,15.09 LED8.K
N$35
  Top 0.152: Q2.2 63.55,20.12 63.55,22.4 65.23,24.08 IC2.10 65.38,24.08 68.12,21.34 68.89,21.34 C12.2
NETLIGHT
  Top 0.152: U2.52 56.08,73.91 56.84,73.91 57.61,73.15 57.61,57.45 52.12,51.97 44.2,51.97 42.37,50.14 41.45,50.14 39.17,52.43 39.17,53.95 R19.2
NETLIGHT_INFO
  Top 0.152: R29.2 28.19,67.97 28.19,62.18 31.85,58.52 31.85,57.76 T1.3
PWRKEY
  Top 0.152: U2.1 59.89,53.95 59.89,47.4 58.83,46.33 RESET_GSM.3
  Bottom 0.152: 60.66,44.35 63.55,44.35 64.47,45.26 66.9,45.26 T3.3 | 60.66,44.35 58.83,46.18 RESET_GSM.3 | 60.66,44.35 58.83,42.52 58.83,39.78 RESET_GSM.4
PWRKEY_OUT
  Top 0.152: U2.2 61.11,53.95 61.11,48.46 63.25,46.33 RESET_GSM.1 63.4,46.18 63.4,39.78 RESET_GSM.2
RESET
  Top 0.152: IC2.1 42.37,24.23 39.78,24.23 38.1,25.91 D3.A 37.95,25.91 35.05,25.91 R4.1 34.9,25.91 34.9,22.55 34.75,22.4 RESET.3 34.75,15.85 RESET.4 34.75,15.7 40.39,10.06 40.39,5.79 ISP.5
RF_ANT
  Top 0.152: U2.60 55.93,66.14 51.51,66.14 42.22,75.44 40.54,75.44 X1.1
RXD
  Top 0.152: Q4.D 52.58,41 52.58,40.39 50.14,37.95 R24.1 49.99,37.8 49.23,37.03 49.23,31.55 45.11,27.43 45.11,24.23 IC2.2 44.96,24.08 42.06,21.18 42.06,5.64 40.54,4.12 40.54,3.2 ISP.6
SCK
  Top 0.152: IC2.19 65.38,31.85 65.99,31.85 73.76,39.62 91.44,39.62 92.35,40.54 M1.5
  Bottom 0.152: ISP.7 38.1,5.64 39.01,5.64 40.54,4.12 49.07,4.12 52.12,1.07 62.48,1.07 63.7,2.29 63.7,18.59 64.47,19.36 64.47,30.94 65.23,31.7 IC2.19
SCL
  Top 0.152: IC7.6 93.27,48.31 93.27,47.7 90.07,44.5 75.74,44.5 71.48,40.23 65.68,40.23 64.31,38.86 64.31,38.56 63.7,37.95 57,37.95 53.03,41.91 52.43,41.91 45.87,35.36 45.87,30.79 45.41,30.33 43.89,30.33 42.52,31.7 IC2.28 42.37,31.85 40.69,31.85 35.05,37.49 35.05,37.8 R32.2
SCLK
  Top 0.152: IC6.7 87.94,30.18 83.67,30.18 82.45,31.39 81.99,31.39 IC6.9
SDA
  Top 0.152: 38.1,38.1 38.1,37.95 R33.2 38.1,38.1 | 38.1,38.1 38.1,43.89 43.43,49.23 51.51,49.23 58.52,56.24 75.44,56.24 76.66,55.02 76.66,49.84 78.03,48.46 92.05,48.46 IC7.5 | 38.1,38.1 44.35,31.85 44.96,31.85 IC2.27
SIM_CLK
  Top 0.152: U2.32 79.86,72.08 60.05,72.08 55.32,76.81 39.93,76.81 34.14,71.02 34.14,62.94 R17.2
SIM_DATA  (via drill 0.3)
  Top 0.152: v61.72,70.87 79.86,70.87 U2.31
  Bottom 0.152: v61.72,70.87 55.78,70.87 42.06,57.15 R27.1
SIM_RST  (via drill 0.3)
  Top 0.152: v60.05,73 79.86,73 U2.33
  Bottom 0.152: v60.05,73 56.69,73 47.55,63.86 32,63.86 31.09,62.94 R18.2
SIM_VDD
  Top 0.152: U2.30 79.86,70.1 61.57,70.1 56.69,74.98 47.24,74.98 C19.1
  Bottom 0.152: SIMHOLDER.1 49.99,73.61 48.62,73.61 47.24,74.98 C19.1
SOFTRESET
  Top 0.152: R12.1 75.13,34.9 75.13,32.16 75.44,31.85 IC2.15
STATUS
  Top 0.152: U2.66 55.93,59.89 55.17,59.89 53.03,57.76 53.03,55.02 52.12,54.1 R13.2
STATUS_INFO
  Top 0.152: R15.2 28.19,70.87 28.19,69.65 33.07,64.77 33.07,62.64 35.36,60.35 35.97,60.35 T2.3
TEMP
  Top 0.152: IC2.24 52.73,31.85 52.73,34.75 53.95,35.97 53.95,37.8 IC5.2
TXD
  Top 0.152: Q3.D 52.58,46.02 47.24,46.02 44.35,48.92 43.59,48.92 43.13,48.46 43.13,41.76 46.94,37.95 R2.1 | ISP.4 43.13,3.2 43.13,4.27 44.5,5.64 44.5,21.03 47.55,24.08 IC2.3
  Bottom 0.152: IC2.3 47.55,24.23 47.55,30.02 46.63,30.94 46.63,37.49 46.94,37.8 R2.1
VBAT
  Top 0.152: R8.1 31.85,37.95 31.85,43.43 21.18,54.1 C15.+ | U2.55 56.08,70.87 56.08,70.1 U2.56 56.08,69.95 56.08,69.04 U2.57 56.08,68.89 56.84,68.89 57.3,68.43 57.3,57.61 52.73,53.03 51.21,53.03 42.06,62.18 C21.+
  Top 0.813: L1.2 17.48,54.46 C15.+
  Bottom 0.152: C15.+ 21.03,54.56 27.58,54.56 35.2,62.18 41.91,62.18 C21.+
VDD_EXT
  Top 0.152: R7.2 41.15,37.95 43.89,37.95 R1.2 | U2.15 73.91,54.1 73.91,54.71 72.69,55.93 59.28,55.93 54.1,50.75 54.1,48.01 Q3.G
  Bottom 0.152: Q3.G 54.1,47.85 54.1,42.98 Q4.G 53.95,42.82 50.14,42.82 45.26,37.95 44.04,37.95 R1.2
VIN_BUTTON
  Bottom 0.813: R11.2 16,58.92 16,33
  Bottom 1.27: JP1.2 C9.2 C11.2 26,3 | 26,3 C14.+ | 26,3 26.73,3.73 C10.+ 26.73,13 C17.+ | C1.1 C17.+ | C17.+ 21.89,14.73 IC1.1 17.54,16.46 16,18 16,27 | C5.1 21.89,26.73 IC3.1 17.46,28.46 16,27 | 16,27 16,33 16,33.27 C13.+ 19.73,38.23 IC4.1
VIN_JACK
  Bottom 1.27: D2.C 19.65,12.08 JP1.1

### Text on the board
tPlace: ArteTechnic2015 | GSC v2.2